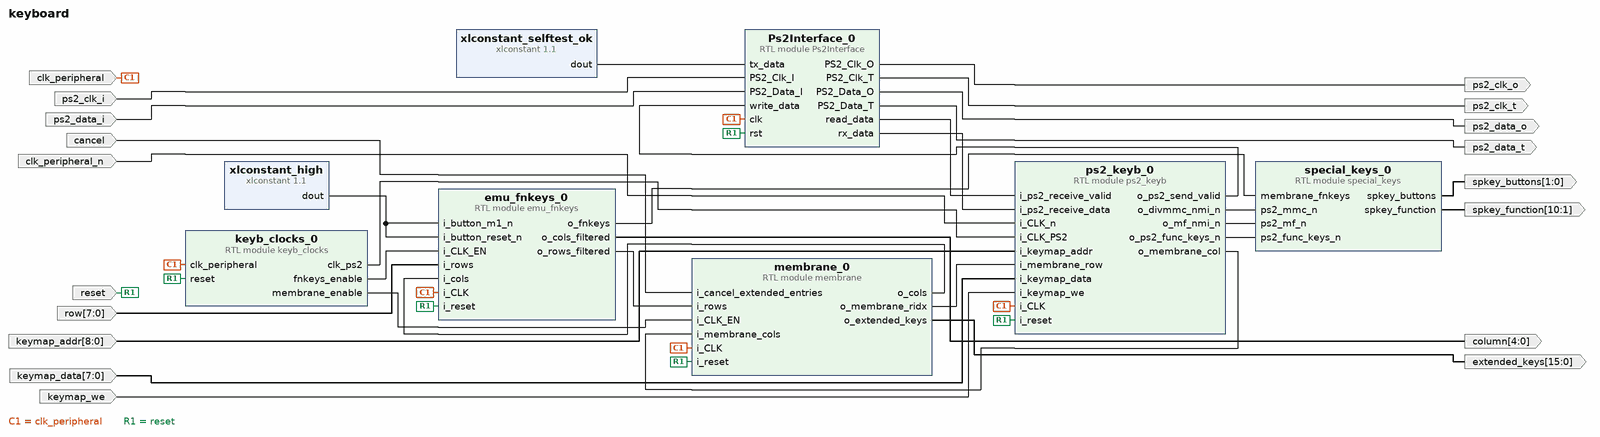
[diagram p0: block diagram of the top level]
# Vivado block design keyboard, xc7a100tcsg324-1, Vivado 2021.2
create_bd_design keyboard

create_bd_port -dir I -type clk clk_peripheral
set_property -dict {CONFIG.FREQ_HZ 28000000} [get_bd_ports clk_peripheral]
create_bd_port -dir I -type rst reset
set_property -dict {CONFIG.POLARITY ACTIVE_HIGH} [get_bd_ports reset]
create_bd_port -dir I -type clk clk_peripheral_n
set_property -dict {CONFIG.FREQ_HZ 28000000} [get_bd_ports clk_peripheral_n]
create_bd_port -dir O -from 10 -to 1 spkey_function
create_bd_port -dir O -from 1 -to 0 spkey_buttons
create_bd_port -dir I cancel
create_bd_port -dir I -from 7 -to 0 row
create_bd_port -dir O -from 4 -to 0 column
create_bd_port -dir O -from 15 -to 0 extended_keys
create_bd_port -dir I ps2_data_i
create_bd_port -dir I ps2_clk_i
create_bd_port -dir O ps2_data_o
create_bd_port -dir O ps2_data_t
create_bd_port -dir O ps2_clk_o
create_bd_port -dir O ps2_clk_t
create_bd_port -dir I -from 8 -to 0 keymap_addr
create_bd_port -dir I -from 7 -to 0 keymap_data
create_bd_port -dir I keymap_we

create_bd_cell -type module -reference special_keys special_keys_0
create_bd_cell -type module -reference membrane membrane_0
create_bd_cell -type module -reference keyb_clocks keyb_clocks_0
create_bd_cell -type module -reference emu_fnkeys emu_fnkeys_0
create_bd_cell -type module -reference ps2_keyb ps2_keyb_0
create_bd_cell -type module -reference Ps2Interface Ps2Interface_0
create_bd_cell -type ip -vlnv xilinx.com:ip:xlconstant:1.1 xlconstant_high
create_bd_cell -type ip -vlnv xilinx.com:ip:xlconstant:1.1 xlconstant_selftest_ok
set_property -dict {CONFIG.CONST_VAL 0x55 CONFIG.CONST_WIDTH 8} [get_bd_cells xlconstant_selftest_ok]

# ---- connections ----

connect_bd_net [get_bd_pins Ps2Interface_0/PS2_Clk_O] [get_bd_ports ps2_clk_o]
connect_bd_net [get_bd_pins Ps2Interface_0/PS2_Clk_T] [get_bd_ports ps2_clk_t]
connect_bd_net [get_bd_pins Ps2Interface_0/PS2_Data_O] [get_bd_ports ps2_data_o]
connect_bd_net [get_bd_pins Ps2Interface_0/PS2_Data_T] [get_bd_ports ps2_data_t]
connect_bd_net [get_bd_pins Ps2Interface_0/read_data] [get_bd_pins ps2_keyb_0/i_ps2_receive_valid]
connect_bd_net [get_bd_pins Ps2Interface_0/rx_data] [get_bd_pins ps2_keyb_0/i_ps2_receive_data]
connect_bd_net [get_bd_ports cancel] [get_bd_pins membrane_0/i_cancel_extended_entries]
connect_bd_net [get_bd_ports clk_peripheral] \
  [get_bd_pins keyb_clocks_0/clk_peripheral] [get_bd_pins Ps2Interface_0/clk] [get_bd_pins membrane_0/i_CLK] \
  [get_bd_pins emu_fnkeys_0/i_CLK] [get_bd_pins ps2_keyb_0/i_CLK]
connect_bd_net [get_bd_ports clk_peripheral_n] [get_bd_pins ps2_keyb_0/i_CLK_n]
connect_bd_net [get_bd_pins emu_fnkeys_0/o_cols_filtered] [get_bd_ports column]
connect_bd_net [get_bd_pins emu_fnkeys_0/o_fnkeys] [get_bd_pins special_keys_0/membrane_fnkeys]
connect_bd_net [get_bd_pins emu_fnkeys_0/o_rows_filtered] [get_bd_pins membrane_0/i_rows]
connect_bd_net [get_bd_pins keyb_clocks_0/clk_ps2] [get_bd_pins ps2_keyb_0/i_CLK_PS2]
connect_bd_net [get_bd_pins keyb_clocks_0/fnkeys_enable] [get_bd_pins emu_fnkeys_0/i_CLK_EN]
connect_bd_net [get_bd_pins keyb_clocks_0/membrane_enable] [get_bd_pins membrane_0/i_CLK_EN]
connect_bd_net [get_bd_ports keymap_addr] [get_bd_pins ps2_keyb_0/i_keymap_addr]
connect_bd_net [get_bd_ports keymap_data] [get_bd_pins ps2_keyb_0/i_keymap_data]
connect_bd_net [get_bd_ports keymap_we] [get_bd_pins ps2_keyb_0/i_keymap_we]
connect_bd_net [get_bd_pins membrane_0/o_cols] [get_bd_pins emu_fnkeys_0/i_cols]
connect_bd_net [get_bd_pins membrane_0/o_extended_keys] [get_bd_ports extended_keys]
connect_bd_net [get_bd_pins membrane_0/o_membrane_ridx] [get_bd_pins ps2_keyb_0/i_membrane_row]
connect_bd_net [get_bd_ports ps2_clk_i] [get_bd_pins Ps2Interface_0/PS2_Clk_I]
connect_bd_net [get_bd_ports ps2_data_i] [get_bd_pins Ps2Interface_0/PS2_Data_I]
connect_bd_net [get_bd_pins ps2_keyb_0/o_divmmc_nmi_n] [get_bd_pins special_keys_0/ps2_mmc_n]
connect_bd_net [get_bd_pins ps2_keyb_0/o_membrane_col] [get_bd_pins membrane_0/i_membrane_cols]
connect_bd_net [get_bd_pins ps2_keyb_0/o_mf_nmi_n] [get_bd_pins special_keys_0/ps2_mf_n]
connect_bd_net [get_bd_pins ps2_keyb_0/o_ps2_func_keys_n] [get_bd_pins special_keys_0/ps2_func_keys_n]
connect_bd_net [get_bd_pins ps2_keyb_0/o_ps2_send_valid] [get_bd_pins Ps2Interface_0/write_data]
connect_bd_net [get_bd_ports reset] \
  [get_bd_pins keyb_clocks_0/reset] [get_bd_pins Ps2Interface_0/rst] [get_bd_pins membrane_0/i_reset] \
  [get_bd_pins emu_fnkeys_0/i_reset] [get_bd_pins ps2_keyb_0/i_reset]
connect_bd_net [get_bd_ports row] [get_bd_pins emu_fnkeys_0/i_rows]
connect_bd_net [get_bd_pins special_keys_0/spkey_buttons] [get_bd_ports spkey_buttons]
connect_bd_net [get_bd_pins special_keys_0/spkey_function] [get_bd_ports spkey_function]
connect_bd_net -net xlconstant_high1_dout [get_bd_pins xlconstant_selftest_ok/dout] [get_bd_pins Ps2Interface_0/tx_data]
connect_bd_net [get_bd_pins xlconstant_high/dout] [get_bd_pins emu_fnkeys_0/i_button_reset_n] [get_bd_pins emu_fnkeys_0/i_button_m1_n]

validate_bd_design
save_bd_design
